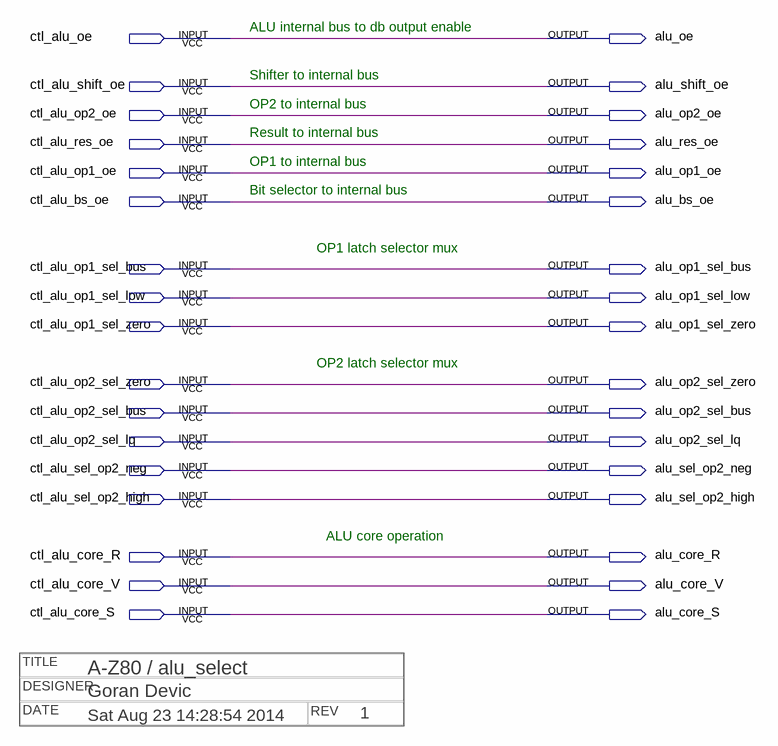
[diagram p0: schematic sheet]
// Quartus schematic alu_select.bdf as structural Verilog: 0 symbols, 34 pins
// Title block: DATE: Sat Aug 23 14:28:54 2014; DESIGNER: Goran Devic; REV: 1; TITLE: A-Z80 / alu_select
module alu_select (
  input  ctl_alu_oe,
  input  ctl_alu_shift_oe,
  input  ctl_alu_op2_oe,
  input  ctl_alu_res_oe,
  input  ctl_alu_op1_oe,
  input  ctl_alu_bs_oe,
  input  ctl_alu_op1_sel_bus,
  input  ctl_alu_op1_sel_low,
  input  ctl_alu_op1_sel_zero,
  input  ctl_alu_op2_sel_zero,
  input  ctl_alu_op2_sel_bus,
  input  ctl_alu_op2_sel_lq,
  input  ctl_alu_sel_op2_neg,
  input  ctl_alu_sel_op2_high,
  input  ctl_alu_core_R,
  input  ctl_alu_core_V,
  input  ctl_alu_core_S,
  output alu_oe,
  output alu_shift_oe,
  output alu_op2_oe,
  output alu_res_oe,
  output alu_op1_oe,
  output alu_bs_oe,
  output alu_op1_sel_bus,
  output alu_op1_sel_low,
  output alu_op1_sel_zero,
  output alu_op2_sel_zero,
  output alu_op2_sel_bus,
  output alu_op2_sel_lq,
  output alu_sel_op2_neg,
  output alu_sel_op2_high,
  output alu_core_R,
  output alu_core_V,
  output alu_core_S
);


  assign alu_bs_oe = ctl_alu_bs_oe;
  assign alu_core_R = ctl_alu_core_R;
  assign alu_core_S = ctl_alu_core_S;
  assign alu_core_V = ctl_alu_core_V;
  assign alu_oe = ctl_alu_oe;
  assign alu_op1_oe = ctl_alu_op1_oe;
  assign alu_op1_sel_bus = ctl_alu_op1_sel_bus;
  assign alu_op1_sel_low = ctl_alu_op1_sel_low;
  assign alu_op1_sel_zero = ctl_alu_op1_sel_zero;
  assign alu_op2_oe = ctl_alu_op2_oe;
  assign alu_op2_sel_bus = ctl_alu_op2_sel_bus;
  assign alu_op2_sel_lq = ctl_alu_op2_sel_lq;
  assign alu_op2_sel_zero = ctl_alu_op2_sel_zero;
  assign alu_res_oe = ctl_alu_res_oe;
  assign alu_sel_op2_high = ctl_alu_sel_op2_high;
  assign alu_sel_op2_neg = ctl_alu_sel_op2_neg;
  assign alu_shift_oe = ctl_alu_shift_oe;

  // Notes on the sheet:
  //   ALU internal bus to db output enable
  //   Shifter to internal bus
  //   OP2 to internal bus
  //   Result to internal bus
  //   OP1 to internal bus
  //   Bit selector to internal bus
  //   OP1 latch selector mux
  //   OP2 latch selector mux
  //   ALU core operation
endmodule
